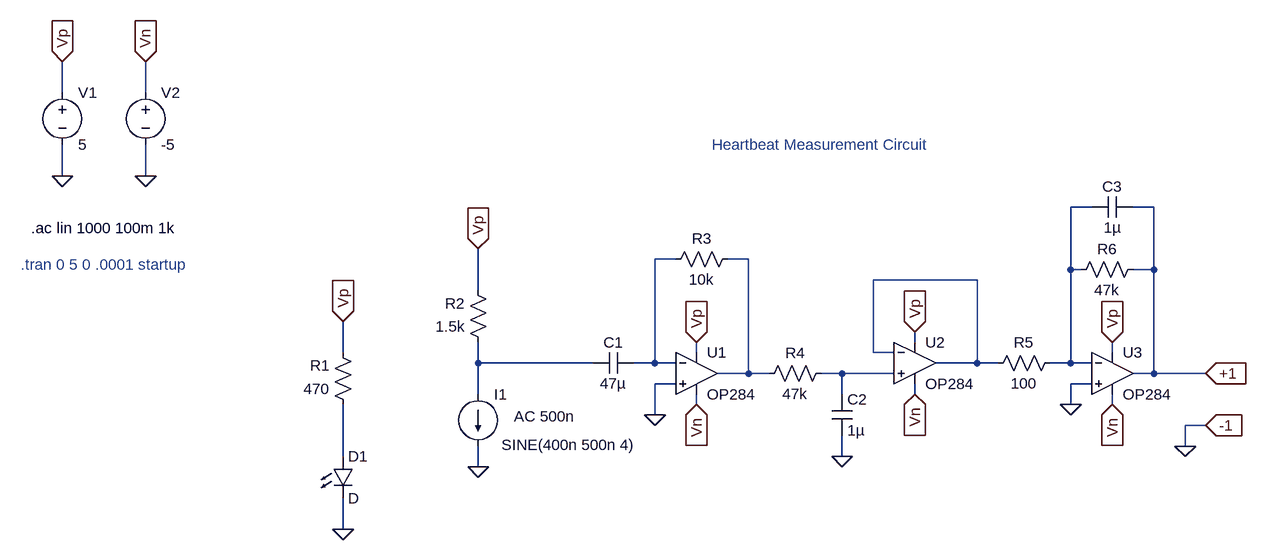
[diagram p0: schematic heartbeat_ltspice.asc]
heartbeat_ltspice.asc, the LTspice schematic file:
Version 4
SHEET 1 1004 680
WIRE -1056 -752 -1056 -800
WIRE -928 -752 -928 -800
WIRE -1056 -624 -1056 -672
WIRE -928 -624 -928 -672
WIRE 528 -576 496 -576
WIRE 624 -576 592 -576
WIRE -112 -496 -144 -496
WIRE 0 -496 -32 -496
WIRE 496 -480 496 -576
WIRE 512 -480 496 -480
WIRE 624 -480 624 -576
WIRE 624 -480 592 -480
WIRE 352 -464 192 -464
WIRE -416 -448 -416 -512
WIRE 256 -368 256 -384
WIRE -624 -352 -624 -400
WIRE -80 -352 -80 -368
WIRE 192 -352 192 -464
WIRE 224 -352 192 -352
WIRE 560 -352 560 -368
WIRE -416 -336 -416 -368
WIRE -240 -336 -416 -336
WIRE -144 -336 -144 -496
WIRE -144 -336 -176 -336
WIRE -112 -336 -144 -336
WIRE 352 -336 352 -464
WIRE 352 -336 288 -336
WIRE 384 -336 352 -336
WIRE 496 -336 496 -480
WIRE 496 -336 464 -336
WIRE 528 -336 496 -336
WIRE 0 -320 0 -496
WIRE 0 -320 -48 -320
WIRE 32 -320 0 -320
WIRE 144 -320 112 -320
WIRE 224 -320 144 -320
WIRE 624 -320 624 -480
WIRE 624 -320 592 -320
WIRE 704 -320 624 -320
WIRE -112 -304 -144 -304
WIRE 528 -304 496 -304
WIRE -416 -288 -416 -336
WIRE 144 -288 144 -320
WIRE 256 -288 256 -304
WIRE -80 -272 -80 -288
WIRE 496 -272 496 -304
WIRE 560 -272 560 -288
WIRE -144 -256 -144 -304
WIRE 704 -240 672 -240
WIRE 672 -208 672 -240
WIRE -624 -192 -624 -272
WIRE 144 -192 144 -224
WIRE -416 -176 -416 -208
WIRE -624 -80 -624 -128
FLAG -1056 -624 0
FLAG -928 -624 0
FLAG -1056 -800 Vp
IOPIN -1056 -800 In
FLAG -928 -800 Vn
IOPIN -928 -800 In
FLAG -416 -176 0
FLAG -144 -256 0
FLAG 144 -192 0
FLAG 256 -288 Vn
IOPIN 256 -288 In
FLAG 256 -384 Vp
IOPIN 256 -384 In
FLAG 496 -272 0
FLAG -80 -368 Vp
IOPIN -80 -368 In
FLAG -80 -272 Vn
IOPIN -80 -272 In
FLAG 560 -368 Vp
IOPIN 560 -368 In
FLAG 560 -272 Vn
IOPIN 560 -272 In
FLAG 672 -208 0
FLAG -624 -400 Vp
IOPIN -624 -400 In
FLAG -624 -80 0
FLAG 704 -320 +1
IOPIN 704 -320 In
FLAG 704 -240 -1
IOPIN 704 -240 In
FLAG -416 -512 Vp
IOPIN -416 -512 In
SYMBOL Opamps\\OP284 -80 -384 R0
SYMATTR InstName U1
SYMBOL Opamps\\OP284 256 -400 R0
SYMATTR InstName U2
SYMBOL Opamps\\OP284 560 -384 R0
SYMATTR InstName U3
SYMBOL cap -176 -352 R90
WINDOW 0 0 32 VBottom 2
WINDOW 3 32 32 VTop 2
SYMATTR InstName C1
SYMATTR Value 47µ
SYMBOL res -16 -512 R90
WINDOW 0 0 56 VBottom 2
WINDOW 3 32 56 VTop 2
SYMATTR InstName R3
SYMATTR Value 10k
SYMBOL res 128 -336 R90
WINDOW 0 0 56 VBottom 2
WINDOW 3 32 56 VTop 2
SYMATTR InstName R4
SYMATTR Value 47k
SYMBOL cap 128 -288 R0
SYMATTR InstName C2
SYMATTR Value 1µ
SYMBOL res 480 -352 R90
WINDOW 0 0 56 VBottom 2
WINDOW 3 32 56 VTop 2
SYMATTR InstName R5
SYMATTR Value 100
SYMBOL res 608 -496 R90
WINDOW 0 0 56 VBottom 2
WINDOW 3 32 56 VTop 2
SYMATTR InstName R6
SYMATTR Value 47k
SYMBOL cap 592 -592 R90
WINDOW 0 0 32 VBottom 2
WINDOW 3 32 32 VTop 2
SYMATTR InstName C3
SYMATTR Value 1µ
SYMBOL res -608 -256 R180
WINDOW 0 36 76 Left 2
WINDOW 3 36 40 Left 2
SYMATTR InstName R1
SYMATTR Value 470
SYMBOL res -400 -352 R180
WINDOW 0 36 76 Left 2
WINDOW 3 36 40 Left 2
SYMATTR InstName R2
SYMATTR Value 1.5k
SYMBOL voltage -1056 -768 R0
WINDOW 123 0 0 Left 0
WINDOW 39 0 0 Left 0
SYMATTR InstName V1
SYMATTR Value 5
SYMBOL voltage -928 -768 R0
WINDOW 123 0 0 Left 0
WINDOW 39 0 0 Left 0
SYMATTR InstName V2
SYMATTR Value -5
SYMBOL LED -640 -192 R0
SYMATTR InstName D1
SYMBOL current -416 -288 R0
WINDOW 3 36 78 Left 2
WINDOW 123 55 34 Left 2
WINDOW 39 0 0 Left 0
SYMATTR InstName I1
SYMATTR Value SINE(400n 500n 4)
SYMATTR Value2 AC 500n
TEXT -1104 -544 Left 2 !.ac lin 1000 100m 1k
TEXT -56 -672 Left 2 ;Heartbeat Measurement Circuit
TEXT -1120 -488 Left 2 ;.tran 0 5 0 .0001 startup

The netlist it stands for:
* heartbeat_ltspice.asc
XU1 0 N002 Vp Vn N003 OP284  ; pins In+ In- V+ V- OUT
XU2 N006 N004 Vp Vn N004 OP284  ; pins In+ In- V+ V- OUT
XU3 0 N001 Vp Vn +1 OP284  ; pins In+ In- V+ V- OUT
C1 N002 N005 47µ
R3 N003 N002 10k
R4 N006 N003 47k
C2 N006 0 1µ
R5 N001 N004 100
R6 +1 N001 47k
C3 +1 N001 1µ
R1 N007 Vp 470
R2 N005 Vp 1.5k
V1 Vp 0 5
V2 Vn 0 -5
D1 N007 0 D
I1 N005 0 SINE(400n 500n 4) AC 500n
.model D D
.lib standard.dio
.ac lin 1000 100m 1k
* Heartbeat Measurement Circuit
* .tran 0 5 0 .0001 startup
.lib ADI1.lib
.backanno
.end